# EasyEDA Pro project AmpBoard64SMD.eprj, schematic Mod16Top
Create Date: 2023-12-27; Page Name: P1; Project Name: Driver644Layers; Schematic Name: Mod16Top; Update Date: 2023-12-27; Company: EasyEDA.com; Drawed: EasyEDA Pro; Page Size: A4; Part Number: JLCPCB-002; Reviewed: EasyEDA Pro; Version: V0.1
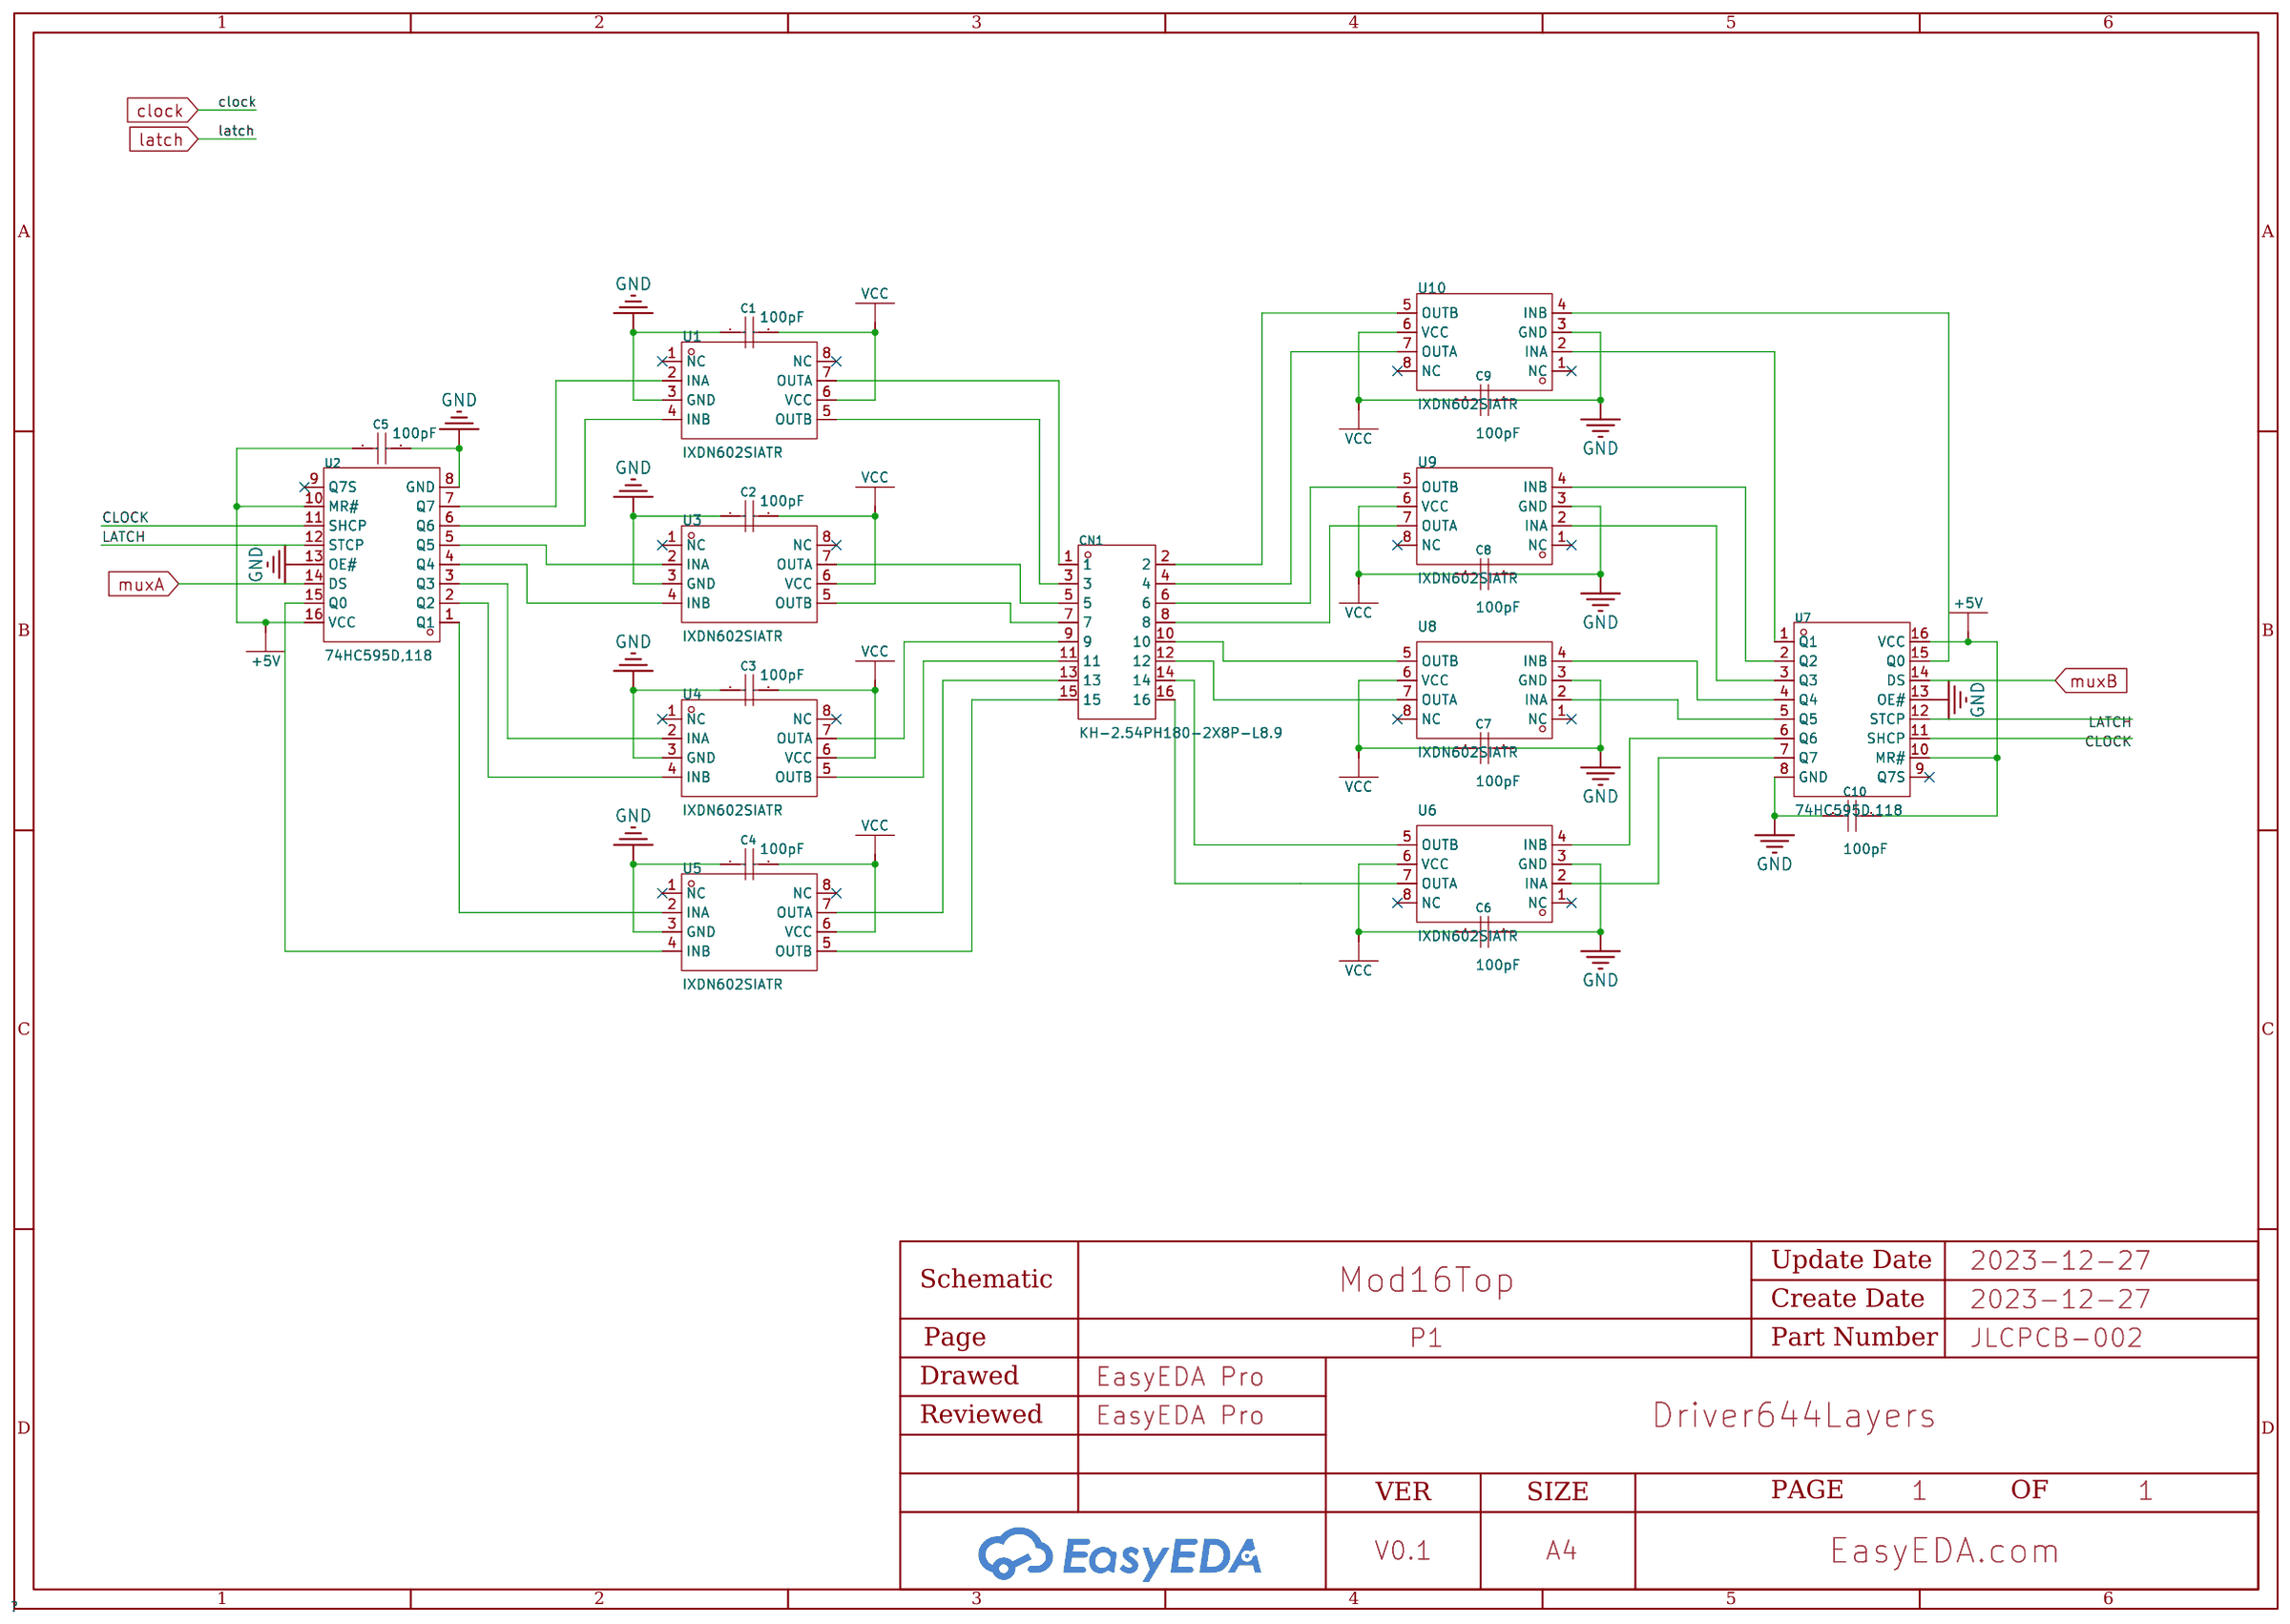
[diagram p1: schematic sheet]

## Parts
C1  100pF  [C0805]
C2  100pF  [C0805]
C3  100pF  [C0805]
C4  100pF  [C0805]
C5  100pF  [C0805]
C6  100pF  [C0805]
C7  100pF  [C0805]
C8  100pF  [C0805]
C9  100pF  [C0805]
C10  100pF  [C0805]
CN1  KH-2.54PH180-2X8P-L8.9  [CONN-TH_16P-P2.54_KINGHELM_KH-2.54PH180-2X8P-L8.9]
U1  IXDN602SIATR  [SOIC-8_L4.9-W3.9-P1.27-LS6.0-BL]
U2  74HC595D,118  [SOIC-16_L9.9-W3.9-P1.27-LS6.0-BL]
U3  IXDN602SIATR  [SOIC-8_L4.9-W3.9-P1.27-LS6.0-BL]
U4  IXDN602SIATR  [SOIC-8_L4.9-W3.9-P1.27-LS6.0-BL]
U5  IXDN602SIATR  [SOIC-8_L4.9-W3.9-P1.27-LS6.0-BL]
U6  IXDN602SIATR  [SOIC-8_L4.9-W3.9-P1.27-LS6.0-BL]
U7  74HC595D,118  [SOIC-16_L9.9-W3.9-P1.27-LS6.0-BL]
U8  IXDN602SIATR  [SOIC-8_L4.9-W3.9-P1.27-LS6.0-BL]
U9  IXDN602SIATR  [SOIC-8_L4.9-W3.9-P1.27-LS6.0-BL]
U10  IXDN602SIATR  [SOIC-8_L4.9-W3.9-P1.27-LS6.0-BL]

## Library data of the parts
C1-C10 = CL21C101JBANNNC: Capacitance: Tolerance:±5% Tolerance:±5% Voltage Rated: Temperature Coefficient:; LCSC Part Name: 100pF ±5% 50V; Supplier Part: C1790; Manufacturer: SAMSUNG(三星); Supplier Footprint: 0805; JLCPCB Part Class: Basic Part; Datasheet: https://atta.szlcsc.com/upload/public/pdf/source/20160218/1457707763339.pdf; Supplier: LCSC; Tolerance: ±5%
CN1 = KH-2.54PH180-2X8P-L8.9: Connector Type:简牛座 Pitch:2.54mm Structure:2x8P Holder Type:Straight Number of Rows:2 Pin Number in each Row:8; LCSC Part Name: 2.54mm 2x8P 排数:2 每排P数:8; Supplier Part: C5157631; Manufacturer: kinghelm(金航标); Supplier Footprint: 插件,P=2.54mm; JLCPCB Part Class: Extended Part; Datasheet: https://atta.szlcsc.com/upload/public/pdf/source/20220902/BDDF6E62C6922AC108506376901906B3.pdf; Supplier: LCSC; Connector Type: 简牛座; Pitch: 2.54mm; Structure: 2x8P; Holder Type: Straight; Number of Rows: 2; Pin Number in each Row: 8
U1 U3-U6 U8-U10 = IXDN602SIATR: Driven Configuration:低边 Number of Drivers:2 loadtype:MOSFET；IGBT Supply Voltage:4.5V~35V Supply Voltage:4.5V~35V Peak Output Current(sink):2A Peak Output Current(source):2A Rise Time:7.5ns Fall Time:6.5ns Operating Temperature:-55℃~+150℃@(Tj) Operating Te; LCSC Part Name: 低边 IGBT MOSFET 灌:2A 拉:2A; Supplier Part: C431679; Manufacturer: IXYS; Supplier Footprint: SOIC-8; JLCPCB Part Class: Extended Part; Datasheet: https://atta.szlcsc.com/upload/public/pdf/source/20190927/C431679_ECDAA394D49EC09E90D6B3598B420BD4.pdf; Supplier: LCSC; Driven Configuration: 低边; Number of Drivers: 2; loadtype: MOSFET；IGBT; Supply Voltage: 4.5V~35V; Peak Output Current(sink): 2A; Peak Output Current(source): 2A; Rise Time: 7.5ns; Fall Time: 6.5ns; Operating Temperature: -55℃~+150℃@(Tj)
U2 U7 = 74HC595D,118: Series: Number of Bits per Element:8 Output Type:Tri-State Function:串行至并行或串行 Supply Voltage:2V~6V Supply Voltage:2V~6V Operating Temperature:40℃~+125℃ Operating Temperature:40℃~+125℃; LCSC Part Name: 三态输出 串行至串行或并行移位寄存器; Supplier Part: C5947; Manufacturer: Nexperia(安世); Supplier Footprint: SOP-16; JLCPCB Part Class: Basic Part; Datasheet: https://atta.szlcsc.com/upload/public/pdf/source/20140108/1457706668762.pdf; Supplier: LCSC; Number of Bits per Element: 8; Output Type: Tri-State; Function: 串行至并行或串行; Supply Voltage: 2V~6V; Operating Temperature: 40℃~+125℃

## Nets
+5V: C5.1 C10.1 U2.10(MR#) U2.16(VCC) U7.10(MR#) U7.16(VCC)
GND: C1.1 C2.1 C3.1 C4.1 C5.2 C6.1 C7.1 C8.1 C9.1 C10.2 U1.3(GND) U2.8(GND) U2.13(OE#) U3.3(GND) U4.3(GND) U5.3(GND) U6.3(GND) U7.8(GND) U7.13(OE#) U8.3(GND) U9.3(GND) U10.3(GND)
VCC: C1.2 C2.2 C3.2 C4.2 C6.2 C7.2 C8.2 C9.2 U1.6(VCC) U3.6(VCC) U4.6(VCC) U5.6(VCC) U6.6(VCC) U8.6(VCC) U9.6(VCC) U10.6(VCC)
CLOCK: U2.11(SHCP) U7.11(SHCP)
LATCH: U2.12(STCP) U7.12(STCP)
muxA: U2.14(DS)
muxB: U7.14(DS)
$1N942: CN1.1 U1.7(OUTA)
$1N946: CN1.3 U1.5(OUTB)
$1N951: CN1.5 U3.7(OUTA)
$1N956: CN1.7 U3.5(OUTB)
$1N961: CN1.9 U4.7(OUTA)
$1N970: CN1.11 U4.5(OUTB)
$1N975: CN1.13 U5.7(OUTA)
$1N980: CN1.15 U5.5(OUTB)
$1N1841: CN1.16 U6.7(OUTA)
$1N1844: CN1.14 U6.5(OUTB)
$1N1848: CN1.12 U8.7(OUTA)
$1N1852: CN1.10 U8.5(OUTB)
$1N1856: CN1.8 U9.7(OUTA)
$1N1860: CN1.6 U9.5(OUTB)
$1N1864: CN1.4 U10.7(OUTA)
$1N1868: CN1.2 U10.5(OUTB)
$1N2749: U2.15(Q0) U5.4(INB)
$1N2754: U2.1(Q1) U5.2(INA)
$1N2758: U2.2(Q2) U4.4(INB)
$1N2763: U2.3(Q3) U4.2(INA)
$1N2768: U2.4(Q4) U3.4(INB)
$1N2773: U2.5(Q5) U3.2(INA)
$1N2778: U1.4(INB) U2.6(Q6)
$1N2783: U1.2(INA) U2.7(Q7)
$1N2803: U7.15(Q0) U10.4(INB)
$1N2813: U7.1(Q1) U10.2(INA)
$1N2823: U7.2(Q2) U9.4(INB)
$1N2835: U7.3(Q3) U9.2(INA)
$1N2845: U7.4(Q4) U8.4(INB)
$1N2857: U7.5(Q5) U8.2(INA)
$1N2869: U6.4(INB) U7.6(Q6)
$1N2881: U6.2(INA) U7.7(Q7)

Not connected (* = marked no-connect by the designer): U1 1(NC)* 8(NC)*; U2 9(Q7S)*; U3 1(NC)* 8(NC)*; U4 1(NC)* 8(NC)*; U5 1(NC)* 8(NC)*; U6 1(NC)* 8(NC)*; U7 9(Q7S)*; U8 1(NC)* 8(NC)*; U9 1(NC)* 8(NC)*; U10 1(NC)* 8(NC)*
